# EAGLE design ledmatrix (EAGLE 6.2)
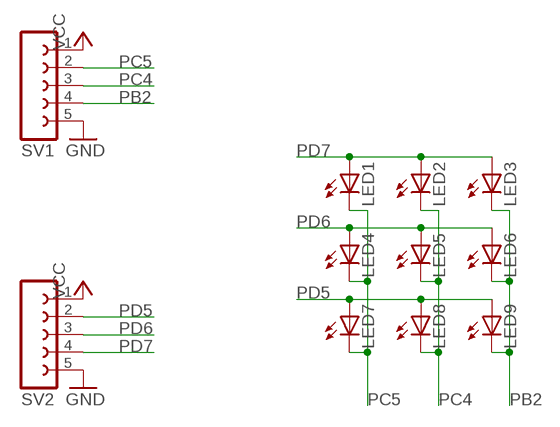
[diagram p0: schematic, sheet 1]

## Parts
LED1  LED5MM  [LED5MM]
LED2  LED5MM  [LED5MM]
LED3  LED5MM  [LED5MM]
LED4  LED5MM  [LED5MM]
LED5  LED5MM  [LED5MM]
LED6  LED5MM  [LED5MM]
LED7  LED5MM  [LED5MM]
LED8  LED5MM  [LED5MM]
LED9  LED5MM  [LED5MM]
SV1  FE05-1  [FE05-1]
SV2  FE05-1  [FE05-1]

## Nets
GND: SV1.5 SV2.5
PB2: LED3.K(C) LED6.K(C) LED9.K(C) SV1.4
PC4: LED2.K(C) LED5.K(C) LED8.K(C) SV1.3
PC5: LED1.K(C) LED4.K(C) LED7.K(C) SV1.2
PD5: LED7.A LED8.A LED9.A SV2.2
PD6: LED4.A LED5.A LED6.A SV2.3
PD7: LED1.A LED2.A LED3.A SV2.4
VCC: SV1.1 SV2.1

## Library data of the parts
LED1-LED9 = SparkFun:LED: LEDs Standard schematic elements and footprints for 5mm, 3mm, 1206, and 0603 sized LEDs. 5mm - Spark Fun Electronics SKU : COM-00529 (and others)
SV1 SV2 = con-lsta:FE05-1: FEMALE HEADER; OC_FARNELL: unknown; OC_NEWARK: unknown

## Board
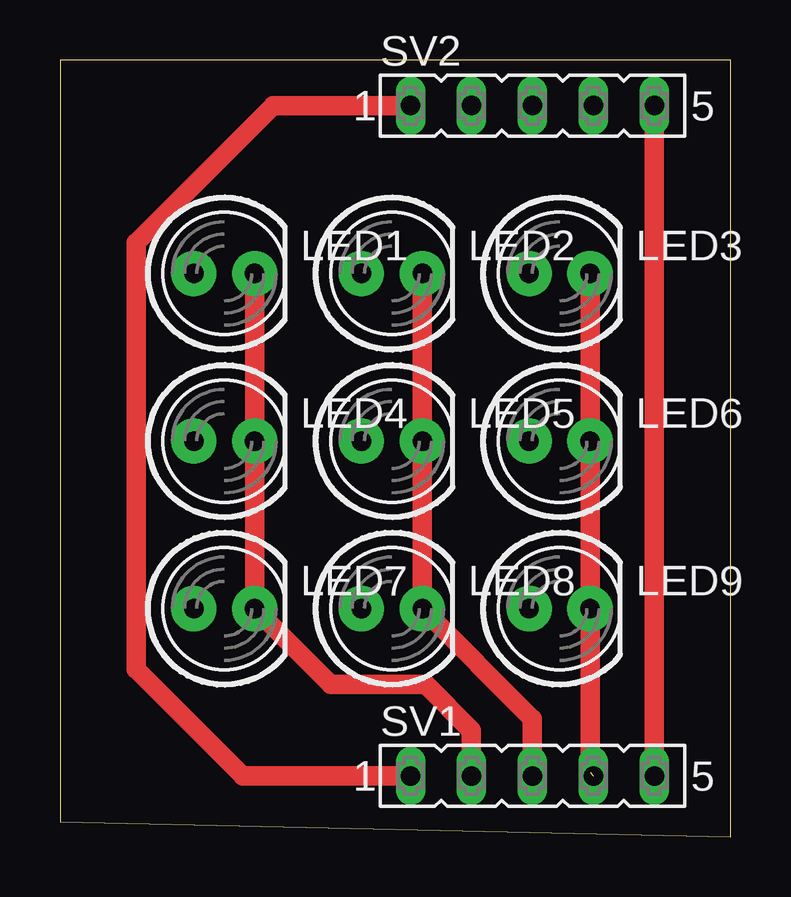
[diagram p1: board, top side]
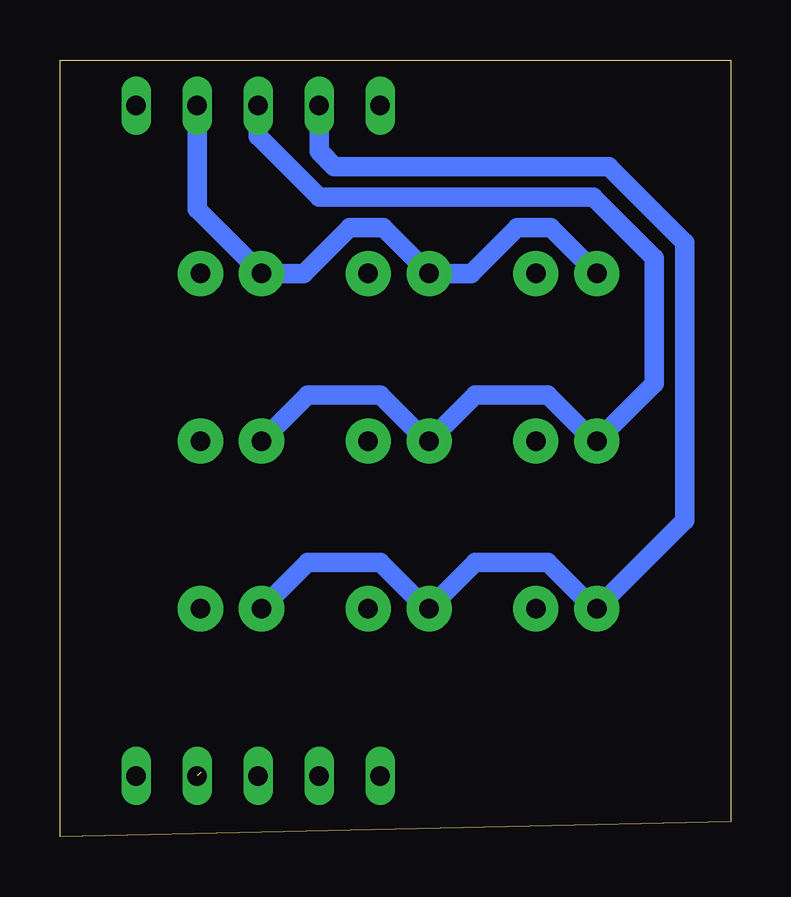
[diagram p2: board, bottom side, seen from below]

Size 27.94 x 32.38 mm. Coordinates in mm from the lower left corner, seen from the top.
Outline: 0,0.64 27.94,0 27.94,32.38 0,32.38 0,0.64
Copper layers (1*16): Top 0.0356mm / dielectric 1.5011mm / Bottom 0.0356mm
Design rules: minimum track width 6mil, minimum drill 13mil, track to track 6mil, track to pad 6mil, pad to pad 6mil, via to via 6mil, smd to smd 6mil, copper to edge 15mil, drill to drill 6mil, minimum pad ring 7mil, minimum via ring 7mil, stop-mask expansion 4mil, vias tented up to drill 0mil, thermal gap 10mil

### Footprints (pad centres in the part's own frame; a part is rotated, then mirrored left to right if it is on the bottom)
LED5MM = drill 0.813 pad 1.88: A -1.27,0; K 1.27,0
FE05-1 = drill 0.813 long: 1 -5.08,0; 2 -2.54,0; 3 0,0; 4 2.54,0; 5 5.08,0

### Placement (x,y rotation side)
LED1  6.84,23.48 0 top
LED2  13.83,23.48 0 top
LED3  20.81,23.48 0 top
LED4  6.84,16.5 0 top
LED5  13.83,16.5 0 top
LED6  20.81,16.5 0 top
LED7  6.84,9.51 0 top
LED8  13.83,9.51 0 top
LED9  20.81,9.51 0 top
SV1  19.68,2.54 0 top
SV2  19.68,30.48 0 top

### Tracks (layer width: path | path; a pad name or v marks a point on that pad's centre or on a via)
GND
  Top 0.813: SV1.5 SV2.5
PB2  (1 unrouted)
  Top 0.813: LED3.K LED6.K LED9.K | LED9.K | LED9.K 22.08,2.68
PC4
  Top 0.813: LED5.K LED8.K 19.68,4.93 SV1.3 | LED5.K | LED5.K LED2.K | LED2.K
PC5
  Top 0.813: LED4.K LED7.K 11.28,6.35 15.24,6.35 17.14,4.45 SV1.2 | LED4.K | LED4.K LED1.K | LED1.K
PD5
  Bottom 0.813: SV2.2 17.14,28.57 16.51,27.94 5.08,27.94 1.91,24.77 1.91,13.18 LED7.A 5.7,9.51 7.62,11.43 10.64,11.43 LED8.A 12.69,9.51 14.61,11.43 17.63,11.43 LED9.A
PD6
  Bottom 0.813: SV2.3 19.68,29.21 17.14,26.67 5.71,26.67 3.17,24.13 3.17,18.9 LED4.A 5.7,16.5 7.62,18.41 10.64,18.41 LED5.A 12.69,16.5 14.61,18.41 17.63,18.41 LED6.A
PD7
  Bottom 0.813: SV2.4 22.23,26.16 LED3.A 17.79,23.48 15.88,25.4 14.48,25.4 LED2.A 10.81,23.48 8.89,25.4 7.49,25.4 LED1.A
VCC
  Top 0.813: SV2.1 8.89,30.48 3.17,24.77 3.17,6.99 7.62,2.54 SV1.1